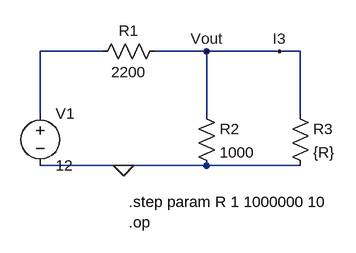
[diagram p0: schematic Draft1.asc]
Draft1.asc, the LTspice schematic file:
Version 4
SHEET 1 880 680
WIRE 176 32 80 32
WIRE 336 32 256 32
WIRE 448 32 336 32
WIRE 480 32 448 32
WIRE 80 128 80 32
WIRE 336 128 336 32
WIRE 480 128 480 32
WIRE 208 208 80 208
WIRE 336 208 208 208
WIRE 480 208 336 208
FLAG 208 208 0
FLAG 336 32 Vout
FLAG 448 32 I3
SYMBOL voltage 80 112 R0
WINDOW 123 0 0 Left 2
WINDOW 39 0 0 Left 2
SYMATTR InstName V1
SYMATTR Value 12
SYMBOL res 272 16 R90
WINDOW 0 0 56 VBottom 2
WINDOW 3 32 56 VTop 2
SYMATTR InstName R1
SYMATTR Value 2200
SYMBOL res 320 112 R0
SYMATTR InstName R2
SYMATTR Value 1000
SYMBOL res 464 112 R0
SYMATTR InstName R3
SYMATTR Value {R}
TEXT 216 264 Left 2 !.step param R 1 1000000 10\n.op

The netlist it stands for:
* Draft1.asc
V1 N001 0 12
R1 I3 N001 2200
R2 I3 0 1000
R3 I3 0 {R}
.step param R 1 1000000 10
.op
.backanno
.end

* Results of the author's LTspice run, read from the files saved beside the schematic
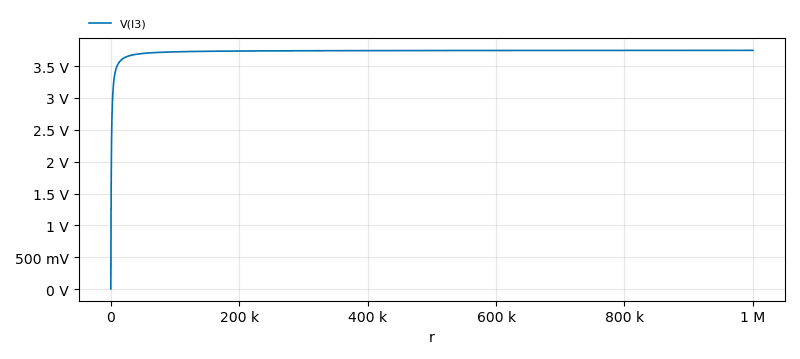
[diagram p1: Operating Point of Draft1.asc, plotted from the saved traces]
* Operating Point, 1 run:
*   V(I3): 5.447 mV at r=1 , 3.747 V at r=1 M, min 5.447 mV, max 3.747 V